# Altium schematic sheet 4-Microcontroller.SchDoc
size 420 x 297 mm; CompanyName: Microchip Technology Inc.; Organization: Microchip Technology; Address1: 2355 West Chandler Blvd.; Address2: Chandler, AZ  85224; Address4: USA; SheetTitle: **; Time: Time
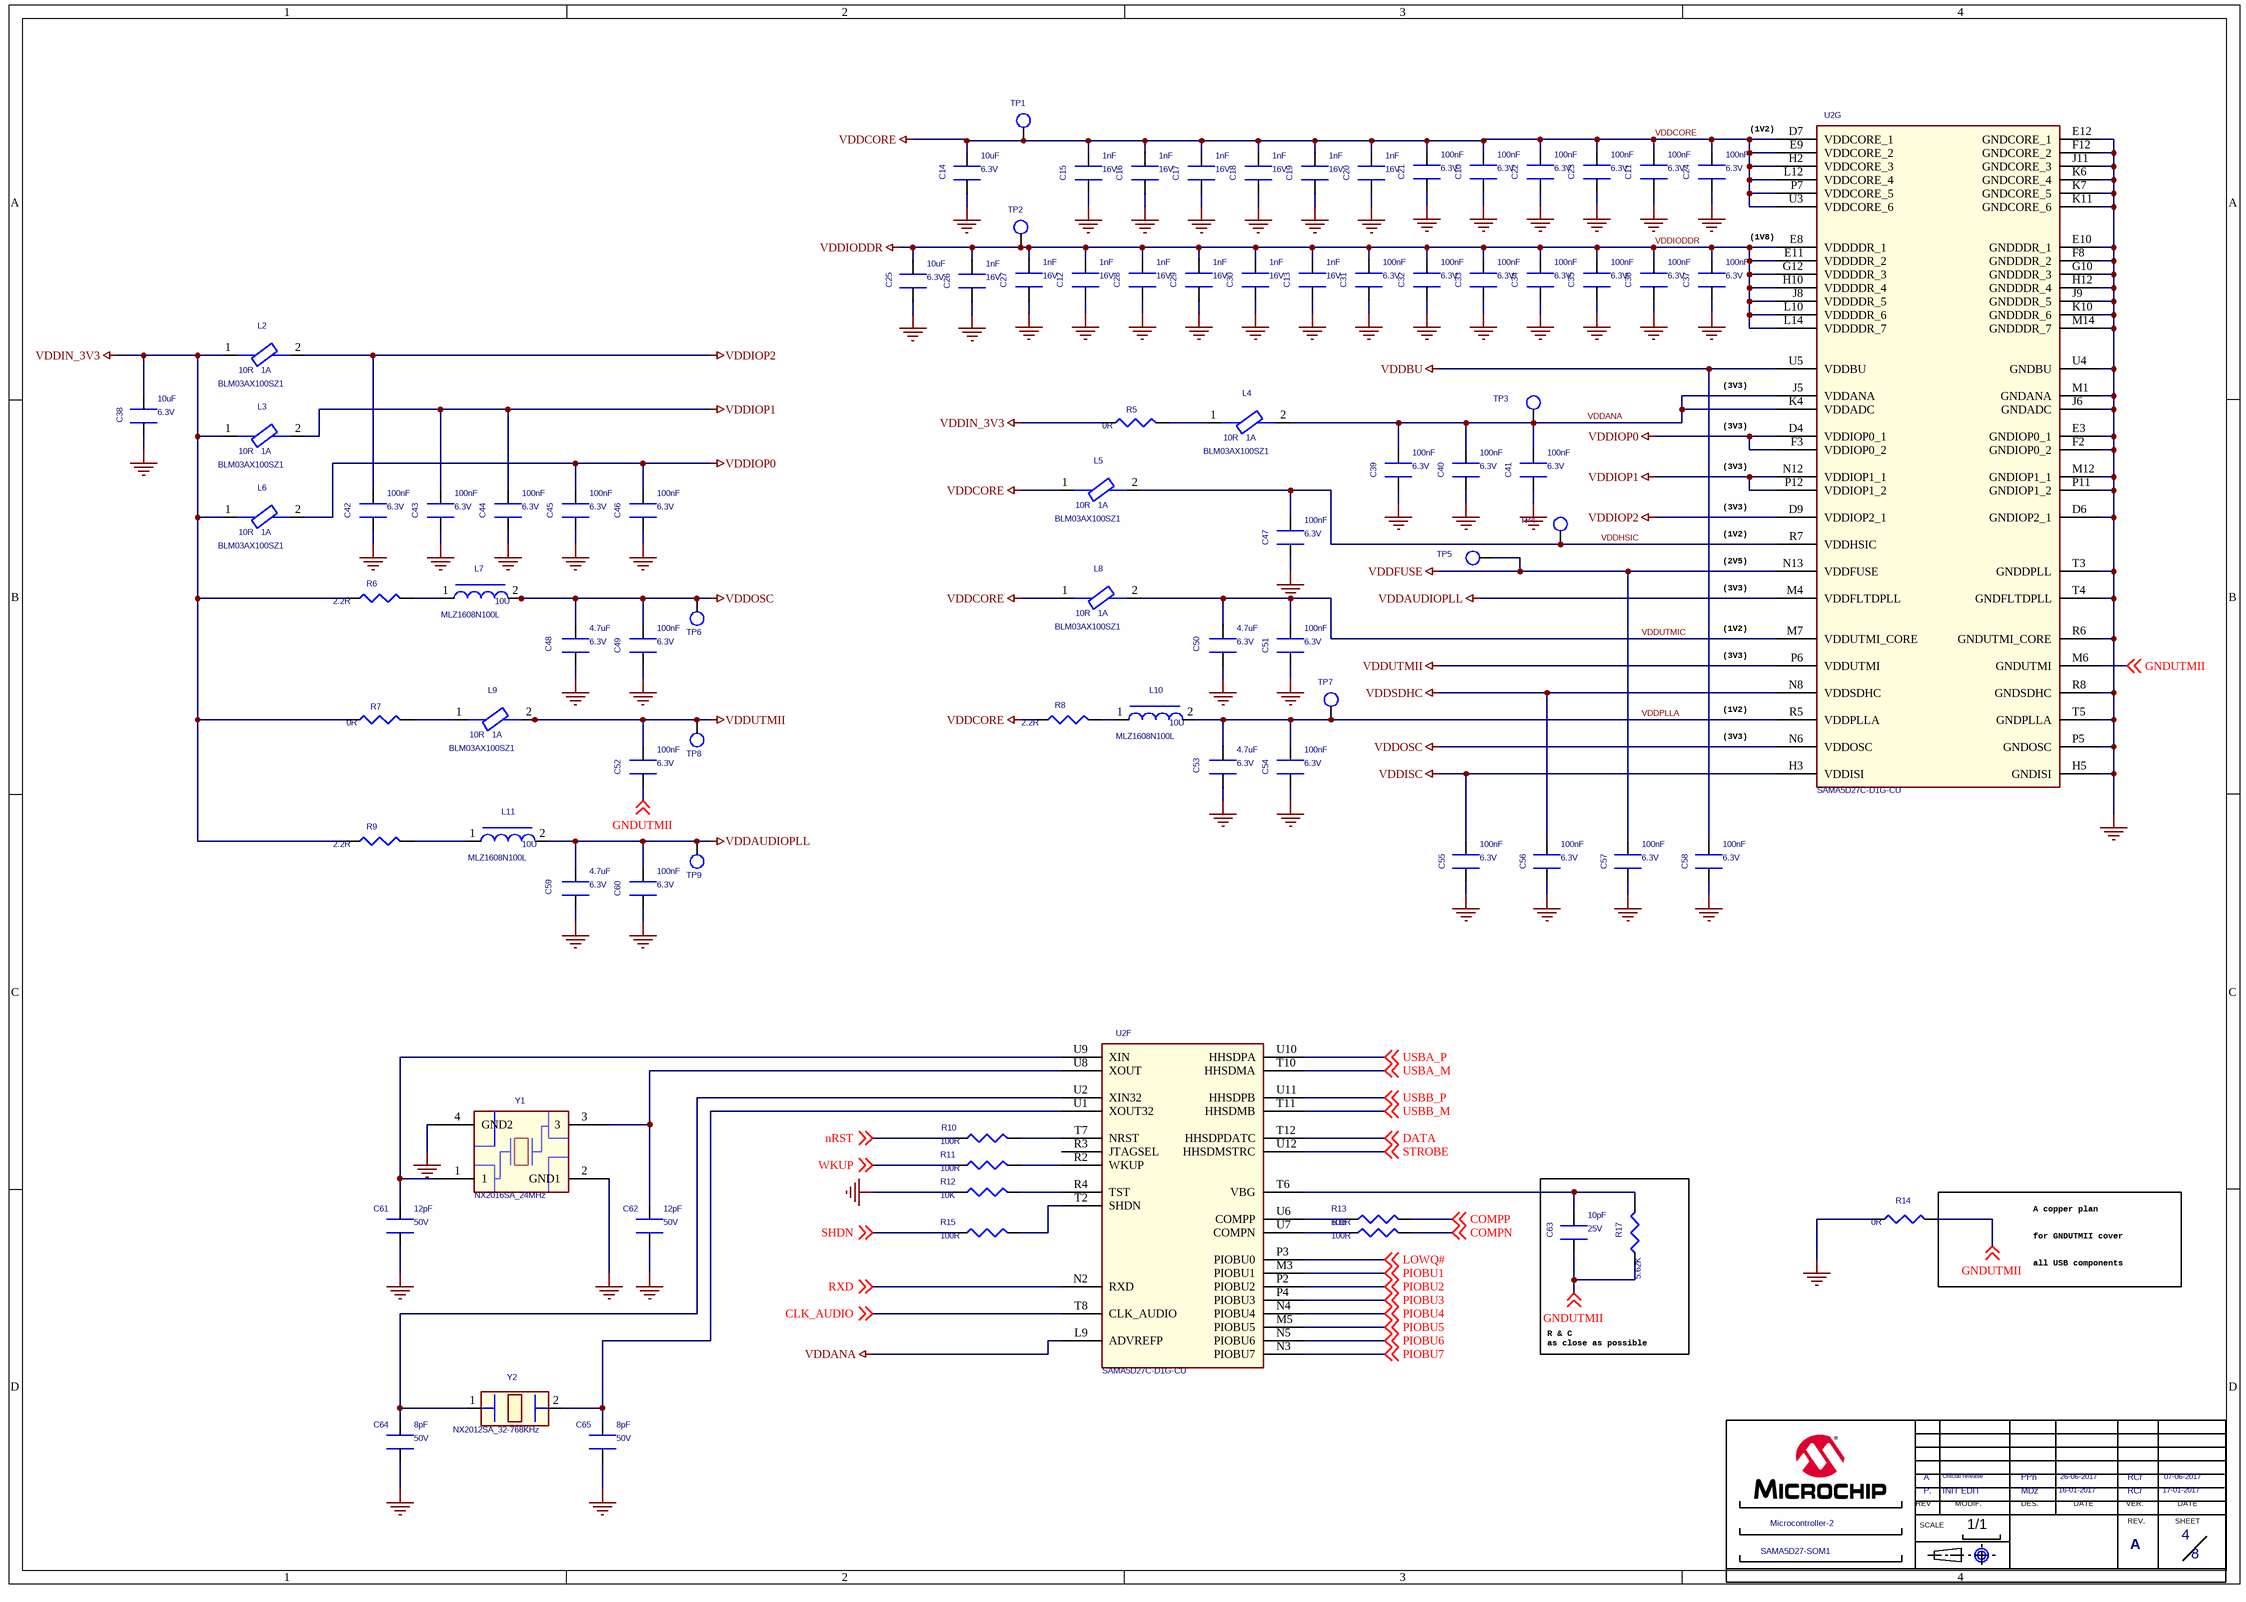
[diagram p0: 4-Microcontroller.SchDoc]

## Parts
*  MODIF.A: INIT EDIT  SHEET NAME 2: Microcontroller-2  SHEET NAME 1: SAMA5D27-SOM1  REV B: A  VERIF B: RCr  VERIF DATE A: 17-01-2017  VERIF DATE B: 07-06-2017  Page Count: 8  Page Number: 4  DATE A: 16-01-2017  DATE B: 26-06-2017  DES A: MDz  DES B: PPn  MODIF.B: Official release  REV A: P.  (hidden comment: CARTOUCHE MICROCHIP)  (graphical)
?  (no value)  (graphical)
C10  VALEUR: 100nF  TENSION: 6.3V  [C0201]  (hidden comment: xpF x% xV)
C11  VALEUR: 100nF  TENSION: 6.3V  [C0201]  (hidden comment: xpF x% xV)
C12  TENSION: 16V  VALEUR: 1nF  [C0201]  (hidden comment: xpF x% xV)
C13  TENSION: 16V  VALEUR: 1nF  [C0201]  (hidden comment: xpF x% xV)
C14  TENSION: 6.3V  VALEUR: 10uF  [C0402]  (hidden comment: xpF x% xV)
C15  TENSION: 16V  VALEUR: 1nF  [C0201]  (hidden comment: xpF x% xV)
C16  TENSION: 16V  VALEUR: 1nF  [C0201]  (hidden comment: xpF x% xV)
C17  TENSION: 16V  VALEUR: 1nF  [C0201]  (hidden comment: xpF x% xV)
C18  TENSION: 16V  VALEUR: 1nF  [C0201]  (hidden comment: xpF x% xV)
C19  TENSION: 16V  VALEUR: 1nF  [C0201]  (hidden comment: xpF x% xV)
C20  TENSION: 16V  VALEUR: 1nF  [C0201]  (hidden comment: xpF x% xV)
C21  VALEUR: 100nF  TENSION: 6.3V  [C0201]  (hidden comment: xpF x% xV)
C22  VALEUR: 100nF  TENSION: 6.3V  [C0201]  (hidden comment: xpF x% xV)
C23  VALEUR: 100nF  TENSION: 6.3V  [C0201]  (hidden comment: xpF x% xV)
C24  VALEUR: 100nF  TENSION: 6.3V  [C0201]  (hidden comment: xpF x% xV)
C25  TENSION: 6.3V  VALEUR: 10uF  [C0402]  (hidden comment: xpF x% xV)
C26  TENSION: 16V  VALEUR: 1nF  [C0201]  (hidden comment: xpF x% xV)
C27  TENSION: 16V  VALEUR: 1nF  [C0201]  (hidden comment: xpF x% xV)
C28  TENSION: 16V  VALEUR: 1nF  [C0201]  (hidden comment: xpF x% xV)
C29  TENSION: 16V  VALEUR: 1nF  [C0201]  (hidden comment: xpF x% xV)
C30  TENSION: 16V  VALEUR: 1nF  [C0201]  (hidden comment: xpF x% xV)
C31  VALEUR: 100nF  TENSION: 6.3V  [C0201]  (hidden comment: xpF x% xV)
C32  VALEUR: 100nF  TENSION: 6.3V  [C0201]  (hidden comment: xpF x% xV)
C33  VALEUR: 100nF  TENSION: 6.3V  [C0201]  (hidden comment: xpF x% xV)
C34  VALEUR: 100nF  TENSION: 6.3V  [C0201]  (hidden comment: xpF x% xV)
C35  VALEUR: 100nF  TENSION: 6.3V  [C0201]  (hidden comment: xpF x% xV)
C36  VALEUR: 100nF  TENSION: 6.3V  [C0201]  (hidden comment: xpF x% xV)
C37  VALEUR: 100nF  TENSION: 6.3V  [C0201]  (hidden comment: xpF x% xV)
C38  TENSION: 6.3V  VALEUR: 10uF  [C0402]  (hidden comment: xpF x% xV)
C39  VALEUR: 100nF  TENSION: 6.3V  [C0201]  (hidden comment: xpF x% xV)
C40  VALEUR: 100nF  TENSION: 6.3V  [C0201]  (hidden comment: xpF x% xV)
C41  VALEUR: 100nF  TENSION: 6.3V  [C0201]  (hidden comment: xpF x% xV)
C42  VALEUR: 100nF  TENSION: 6.3V  [C0201]  (hidden comment: xpF x% xV)
C43  VALEUR: 100nF  TENSION: 6.3V  [C0201]  (hidden comment: xpF x% xV)
C44  VALEUR: 100nF  TENSION: 6.3V  [C0201]  (hidden comment: xpF x% xV)
C45  VALEUR: 100nF  TENSION: 6.3V  [C0201]  (hidden comment: xpF x% xV)
C46  VALEUR: 100nF  TENSION: 6.3V  [C0201]  (hidden comment: xpF x% xV)
C47  VALEUR: 100nF  TENSION: 6.3V  [C0201]  (hidden comment: xpF x% xV)
C48  TENSION: 6.3V  VALEUR: 4.7uF  [C0402]  (hidden comment: xpF x% xV)
C49  VALEUR: 100nF  TENSION: 6.3V  [C0201]  (hidden comment: xpF x% xV)
C50  TENSION: 6.3V  VALEUR: 4.7uF  [C0402]  (hidden comment: xpF x% xV)
C51  VALEUR: 100nF  TENSION: 6.3V  [C0201]  (hidden comment: xpF x% xV)
C52  VALEUR: 100nF  TENSION: 6.3V  [C0201]  (hidden comment: xpF x% xV)
C53  TENSION: 6.3V  VALEUR: 4.7uF  [C0402]  (hidden comment: xpF x% xV)
C54  VALEUR: 100nF  TENSION: 6.3V  [C0201]  (hidden comment: xpF x% xV)
C55  VALEUR: 100nF  TENSION: 6.3V  [C0201]  (hidden comment: xpF x% xV)
C56  VALEUR: 100nF  TENSION: 6.3V  [C0201]  (hidden comment: xpF x% xV)
C57  VALEUR: 100nF  TENSION: 6.3V  [C0201]  (hidden comment: xpF x% xV)
C58  VALEUR: 100nF  TENSION: 6.3V  [C0201]  (hidden comment: xpF x% xV)
C59  TENSION: 6.3V  VALEUR: 4.7uF  [C0402]  (hidden comment: xpF x% xV)
C60  VALEUR: 100nF  TENSION: 6.3V  [C0201]  (hidden comment: xpF x% xV)
C61  TENSION: 50V  VALEUR: 12pF  [C0201]  (hidden comment: xpF x% xV)
C62  TENSION: 50V  VALEUR: 12pF  [C0201]  (hidden comment: xpF x% xV)
C63  VALEUR: 10pF  TENSION: 25V  [C0201]  (hidden comment: xpF x% xV)
C64  VALEUR: 8pF  TENSION: 50V  [C0201]  (hidden comment: xpF x% xV)
C65  VALEUR: 8pF  TENSION: 50V  [C0201]  (hidden comment: xpF x% xV)
L2  10R   1A  [L0201]
L3  10R   1A  [L0201]
L4  10R   1A  [L0201]
L5  10R   1A  [L0201]
L6  10R   1A  [L0201]
L7  10U  [L0603_02]
L8  10R   1A  [L0201]
L9  10R   1A  [L0201]
L10  10U  [L0603_02]
L11  10U  [L0603_02]
R5  VALEUR: 0R  [R0201]  (hidden comment: xR x% xW)
R6  VALEUR: 2.2R  [R0201]  (hidden comment: xR x% xW)
R7  VALEUR: 0R  [R0201]  (hidden comment: xR x% xW)
R8  VALEUR: 2.2R  [R0201]  (hidden comment: xR x% xW)
R9  VALEUR: 2.2R  [R0201]  (hidden comment: xR x% xW)
R10  VALEUR: 100R  [R0201]  (hidden comment: xR x% xW)
R11  VALEUR: 100R  [R0201]  (hidden comment: xR x% xW)
R12  VALEUR: 10K  [R0201]  (hidden comment: xR x% xW)
R13  VALEUR: 100R  [R0201]  (hidden comment: xR x% xW)
R14  VALEUR: 0R  [R0402]  (hidden comment: xR x% xW)
R15  VALEUR: 100R  [R0201]  (hidden comment: xR x% xW)
R16  VALEUR: 100R  [R0201]  (hidden comment: xR x% xW)
R17  VALEUR: 5.62K  [R0201]  (hidden comment: xR x% xW)
TP1  TP  [tp-cmsrond-1mm_02]  (value not drawn)
TP2  TP  [tp-cmsrond-1mm_02]  (value not drawn)
TP3  TP  [tp-cmsrond-1mm_02]  (value not drawn)
TP4  TP  [tp-cmsrond-1mm_02]  (value not drawn)
TP5  TP  [tp-cmsrond-1mm_02]  (value not drawn)
TP6  TP  [tp-cmsrond-1mm_02]  (value not drawn)
TP7  TP  [tp-cmsrond-1mm_02]  (value not drawn)
TP8  TP  [tp-cmsrond-1mm_02]  (value not drawn)
TP9  TP  [tp-cmsrond-1mm_02]  (value not drawn)
U2  SAMA5D27C-D1G-CU  [BGA289_02]  (parts F,G of 7)
Y1  NX2016SA_24MHz  [QUARTZ-NX2016SA_01]
Y2  NX2012SA_32-768KHz  [QUARTZ-NX2012SA_01]

## Nets
GND: C10.1 C11.1 C12.1 C13.1 C14.1 C15.1 C16.1 C17.1 C18.1 C19.1 C20.1 C21.1 C22.1 C23.1 C24.1 C25.1 C26.1 C27.1 C28.1 C29.1 C30.1 C31.1 C32.1 C33.1 C34.1 C35.1 C36.1 C37.1 C38.1 C39.1 C40.1 C41.1 C42.1 C43.1 C44.1 C45.1 C46.1 C47.1 C48.1 C49.1 C50.1 C51.1 C53.1 C54.1 C55.1 C56.1 C57.1 C58.1 C59.1 C60.1 C61.1 C62.1 C64.1 C65.1 R12.1 R14.1 U2.D6(GNDIOP2_1) U2.E3(GNDIOP0_1) U2.E10(GNDDDR_1) U2.E12(GNDCORE_1) U2.F2(GNDIOP0_2) U2.F8(GNDDDR_2) U2.F12(GNDCORE_2) U2.G10(GNDDDR_3) U2.H5(GNDISI) U2.H12(GNDDDR_4) U2.J6(GNDADC) U2.J9(GNDDDR_5) U2.J11(GNDCORE_3) U2.K6(GNDCORE_4) U2.K7(GNDCORE_5) U2.K10(GNDDDR_6) U2.K11(GNDCORE_6) U2.M1(GNDANA) U2.M12(GNDIOP1_1) U2.M14(GNDDDR_7) U2.P5(GNDOSC) U2.P11(GNDIOP1_2) U2.R6(GNDUTMI_CORE) U2.R8(GNDSDHC) U2.T3(GNDDPLL) U2.T4(GNDFLTDPLL) U2.T5(GNDPLLA) U2.U4(GNDBU) Y1.2(GND1) Y1.4(GND2)
VDDANA: C39.2 C40.2 C41.2 L4.2 TP3.1 U2.J5(VDDANA) U2.K4(VDDADC) U2.L9(ADVREFP)
VDDAUDIOPLL: C59.2 C60.2 L11.2 TP9.1 U2.M4(VDDFLTDPLL)
VDDBU: C58.2 U2.U5(VDDBU)
VDDCORE: C10.2 C11.2 C14.2 C15.2 C16.2 C17.2 C18.2 C19.2 C20.2 C21.2 C22.2 C23.2 C24.2 L5.1 L8.1 R8.1 TP1.1 U2.D7(VDDCORE_1) U2.E9(VDDCORE_2) U2.H2(VDDCORE_3) U2.L12(VDDCORE_4) U2.P7(VDDCORE_5) U2.U3(VDDCORE_6)
VDDFUSE: C57.2 TP5.1 U2.N13(VDDFUSE)
VDDIN_3V3: C38.2 L2.1 L3.1 L6.1 R5.1 R6.1 R7.1 R9.1
VDDIODDR: C12.2 C13.2 C25.2 C26.2 C27.2 C28.2 C29.2 C30.2 C31.2 C32.2 C33.2 C34.2 C35.2 C36.2 C37.2 TP2.1 U2.E8(VDDDDR_1) U2.E11(VDDDDR_2) U2.G12(VDDDDR_3) U2.H10(VDDDDR_4) U2.J8(VDDDDR_5) U2.L10(VDDDDR_6) U2.L14(VDDDDR_7)
VDDIOP0: C45.2 C46.2 L6.2 U2.D4(VDDIOP0_1) U2.F3(VDDIOP0_2)
VDDIOP1: C43.2 C44.2 L3.2 U2.N12(VDDIOP1_1) U2.P12(VDDIOP1_2)
VDDIOP2: C42.2 L2.2 U2.D9(VDDIOP2_1)
VDDISC: C55.2 U2.H3(VDDISI)
VDDOSC: C48.2 C49.2 L7.2 TP6.1 U2.N6(VDDOSC)
VDDSDHC: C56.2 U2.N8(VDDSDHC)
VDDUTMII: C52.2 L9.2 TP8.1 U2.P6(VDDUTMI)
CLK_AUDIO: U2.T8(CLK_AUDIO) ; off-sheet CLK_AUDIO
COMPN: R16.2 ; off-sheet COMPN
COMPP: R13.2 ; off-sheet COMPP
DATA: U2.T12(HHSDPDATC) ; off-sheet DATA
GNDUTMII: C52.1 C63.1 R14.2 R17.1 U2.M6(GNDUTMI) ; off-sheet GNDUTMII
LOWQ#: U2.P3(PIOBU0) ; off-sheet LOWQ#
nRST: R10.1 ; off-sheet nRST
PIOBU1: U2.M3(PIOBU1) ; off-sheet PIOBU1
PIOBU2: U2.P2(PIOBU2) ; off-sheet PIOBU2
PIOBU3: U2.P4(PIOBU3) ; off-sheet PIOBU3
PIOBU4: U2.N4(PIOBU4) ; off-sheet PIOBU4
PIOBU5: U2.M5(PIOBU5) ; off-sheet PIOBU5
PIOBU6: U2.N5(PIOBU6) ; off-sheet PIOBU6
PIOBU7: U2.N3(PIOBU7) ; off-sheet PIOBU7
RXD: U2.N2(RXD) ; off-sheet RXD
SHDN: R15.1 ; off-sheet SHDN
STROBE: U2.U12(HHSDMSTRC) ; off-sheet STROBE
USBA_M: U2.T10(HHSDMA) ; off-sheet USBA_M
USBA_P: U2.U10(HHSDPA) ; off-sheet USBA_P
USBB_M: U2.T11(HHSDMB) ; off-sheet USBB_M
USBB_P: U2.U11(HHSDPB) ; off-sheet USBB_P
VDDHSIC: C47.2 L5.2 TP4.1 U2.R7(VDDHSIC)
VDDPLLA: C53.2 C54.2 L10.2 TP7.1 U2.R5(VDDPLLA)
VDDUTMIC: C50.2 C51.2 L8.2 U2.M7(VDDUTMI_CORE)
WKUP: R11.1 ; off-sheet WKUP
NetC61_2: C61.2 U2.U9(XIN) Y1.1
NetC62_2: C62.2 U2.U8(XOUT) Y1.3
NetC63_2: C63.2 R17.2 U2.T6(VBG)
NetC64_2: C64.2 U2.U2(XIN32) Y2.1
NetC65_2: C65.2 U2.U1(XOUT32) Y2.2
NetL4_1: L4.1 R5.2
NetL7_1: L7.1 R6.2
NetL9_1: L9.1 R7.2
NetL10_1: L10.1 R8.2
NetL11_1: L11.1 R9.2
NetR10_2: R10.2 U2.T7(NRST)
NetR11_2: R11.2 U2.R2(WKUP)
NetR12_2: R12.2 U2.R4(TST)
NetR13_1: R13.1 U2.U6(COMPP)
NetR15_2: R15.2 U2.T2(SHDN)
NetR16_1: R16.1 U2.U7(COMPN)

Not connected (* = marked no-connect by the designer): U2 R3(JTAGSEL)

## Notes on the sheet
- (1V2)
- (1V8)
- (3V3)
- (2V5)
- A copper plan
- for GNDUTMII cover
- all USB components
- R & C
  as close as possible
- Drawn By:
- Engineer:
- PartNumber:
- Project Title
- Sheet Title
- Size
- B
- Revision:
- Sch #:
- Date:
- Sheet
- Designed with
- Altium.com <http://go.altium.com/MicrochipLandingPage_Evaluation.html>
- File:
- (in symbol CARTOUCHE MICROCHIP) REV; MODIF.; DES.; DATE; VER.; SCALE; REV.; SHEET; 1/1

## Library data of the parts
* = CARTOUCHE MICROCHIP: REV D: D; REV C: C; REV F: F; REV E: E; VERIF F: XXX; VERIF DATE F: XX-XXX-XX; MODIF.C: RevC; MODIF.D: RevD; MODIF.E: RevE; MODIF.F: RevF; VERIF E: XXX; VERIF D: XXX; VERIF C: RCr; VERIF A: RCr; VERIF DATE E: XX-XXX-XX; VERIF DATE D: XX-XXX-XX; VERIF DATE C: 07-06-2017; REV: A; FT: ?; Page Size: A; Page Create Date: june 19, 2004; DATE C: 07-06-2017; DATE D: XX-XXX-XX; DATE E: XX-XXX-XX; DATE F: XX-XXX-XX; DES E: XXX; DES F: XXX; DES C: XXX; DES D: XXX
? = Title Block B
C10 C11 C21-C24 C31-C37 C39-C47 C49 C51 C52 C54-C58 C60 = C0201-100nF-X5R-6.3V: DIELECTRIQUE: X5R; BOITIER: 0201; DESIGNATION: Condensateur CMS céramique; TOLERENCE: ?%; HAUTEUR: xmm; COURANT: xA; TEMPERATURE: 40°C/+85°C
C12 C13 C15-C20 C26-C30 = C0201-1nF-X7R-16V-10%: COURANT: xA; HAUTEUR: xmm; TOLERENCE: 10%; DESIGNATION: Condensateur CMS céramique; BOITIER: 0201; DIELECTRIQUE: X7R; TEMPERATURE: 40°C/+85°C
C14 C25 C38 = C0402-10uF-X5R-6.3V: COURANT: xA; HAUTEUR: xmm; TOLERENCE: ?%; DESIGNATION: Condensateur CMS céramique; BOITIER: 0402; DIELECTRIQUE: X5R; TEMPERATURE: 40°C/+85°C
C48 C50 C53 C59 = C0402-4.7uF-X5R-6.3V-10%: COURANT: xA; HAUTEUR: xmm; TOLERENCE: 10%; DESIGNATION: Condensateur CMS céramique; BOITIER: 0402; DIELECTRIQUE: X5R; TEMPERATURE: 40°C/+85°C
C61 C62 = C0201-12pF-C0G-50V: COURANT: xA; HAUTEUR: xmm; TOLERENCE: ?%; DESIGNATION: Condensateur CMS céramique; BOITIER: 0201; DIELECTRIQUE: C0G; TEMPERATURE: 40°C/+85°C
C63 = C0201-10pF-C0G-25V: DIELECTRIQUE: C0G; BOITIER: 0201; DESIGNATION: Condensateur CMS céramique; TOLERENCE: ?%; HAUTEUR: xmm; COURANT: xA; TEMPERATURE: 40°C/+85°C
C64 C65 = C0201-8pF-C0G-50V: DIELECTRIQUE: C0G; BOITIER: 0201; DESIGNATION: Condensateur CMS céramique; TOLERENCE: ?%; HAUTEUR: xmm; COURANT: xA; TEMPERATURE: 40°C/+85°C
L2-L6 L8 L9 = BLM03AX100SZ1: DESIGNATION: Ferrite CMS; type: ???; FABRICANT: MURATA; TOLERANCE: 20%; TEMPERATURE: -55°C/+125°C; Valeur: BLM03AX100SZ1; partnumber: BLM03AX100SZ1
L7 L10 L11 = MLZ1608N100L: type: ???; FABRICANT: TDK; TOLERANCE: 20%; DESIGNATION: Inductance CMS; Valeur: MLZ1608N100L; partnumber: MLZ1608N100L; TEMPERATURE: -55°C/+125°C
R5 R7 = R0201-0R: TENSION: xV; BOITIER: 0201; COURANT: xA; DESIGNATION: Resistance CMS; PUISSANCE: xW; TEMPERATURE: -40°C/+85°C; TOLERANCE: x%
R6 R8 R9 = R0201-2.2R-5%: TOLERANCE: 5%; DESIGNATION: Resistance CMS; COURANT: xA; BOITIER: 0201; TENSION: xV; TEMPERATURE: -40°C/+85°C; PUISSANCE: xW
R10 R11 R15 = R0201-100R-5%: TENSION: xV; BOITIER: 0201; COURANT: xA; DESIGNATION: Resistance CMS; TOLERANCE: 5%; PUISSANCE: xW; TEMPERATURE: -40°C/+85°C
R12 = R0201-10K-5%: TENSION: xV; BOITIER: 0201; COURANT: xA; DESIGNATION: Resistance CMS; TOLERANCE: 5%; PUISSANCE: xW; TEMPERATURE: -40°C/+85°C
R13 R16 = R0201-100R-1%: TOLERANCE: 1%; DESIGNATION: Resistance CMS; COURANT: xA; BOITIER: 0201; TENSION: xV; TEMPERATURE: -40°C/+85°C; PUISSANCE: xW
R14 = R0402-0R: TENSION: xV; BOITIER: 0402; COURANT: xA; DESIGNATION: Resistance CMS; PUISSANCE: xW; TEMPERATURE: -40°C/+85°C; TOLERANCE: x%
R17 = R0201-5.62K-1%: TENSION: xV; BOITIER: 0201; COURANT: xA; DESIGNATION: Resistance CMS; TOLERANCE: 1%; PUISSANCE: xW; TEMPERATURE: -40°C/+85°C
TP1-TP9 = TP: DESIGNATION: POINT DE TEST
U2 = SAMA5D27C-D1G-CU: DESIGNATION: SAMA5D27-SiP; FABRICANT: ATMEL; SPLIT_INST: TRUE; SWAP_INFO: (S1+S2+S3+S4+S5+S6+S7); TEMPERATURE: -40°C/+85°C
Y1 = NX2016SA_24MHz: FABRICANT: NDK; FREQUENCE: 24MHz; DESIGNATION: Quartz 24MHz; TEMPERATURE: -40°C/+85°C
Y2 = NX2012SA_32-768KHz: FABRICANT: NDK; FREQUENCE: 32.768KHz; DESIGNATION: Quartz 32.768KHz; TEMPERATURE: -40°C/+85°C